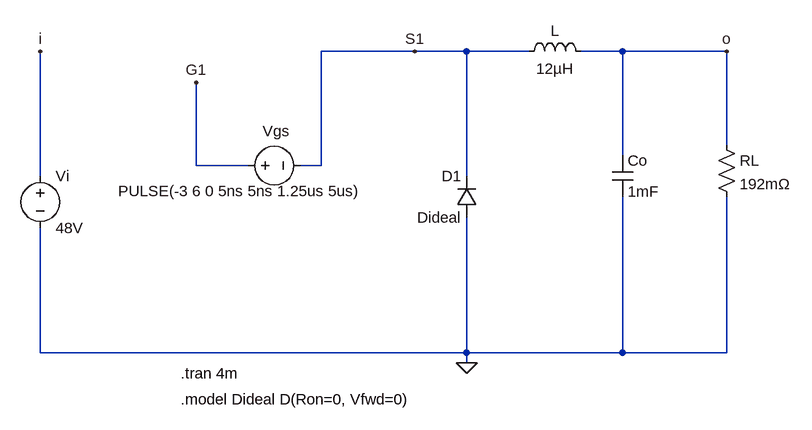
[diagram p0: schematic Project_5224_Buck_template.asc]
Project_5224_Buck_template.asc, the LTspice schematic file:
Version 4
SHEET 1 2328 680
WIRE 1024 -32 880 -32
WIRE 1104 -32 1024 -32
WIRE 1200 -32 1104 -32
WIRE 1344 -32 1280 -32
WIRE 1504 -32 1344 -32
WIRE 1504 112 1504 -32
WIRE 1344 128 1344 -32
WIRE 688 144 688 16
WIRE 768 144 688 144
WIRE 880 144 880 -32
WIRE 880 144 848 144
WIRE 448 160 448 -32
WIRE 1104 160 1104 -32
WIRE 448 432 448 240
WIRE 1104 432 1104 224
WIRE 1104 432 448 432
WIRE 1344 432 1344 192
WIRE 1344 432 1104 432
WIRE 1504 432 1504 192
WIRE 1504 432 1344 432
WIRE 1104 448 1104 432
FLAG 1504 -32 o
FLAG 448 -32 i
FLAG 1024 -32 S1
FLAG 688 16 G1
FLAG 1104 448 0
SYMBOL res 1488 96 R0
SYMATTR InstName RL
SYMATTR Value 192mΩ
SYMBOL voltage 448 144 R0
WINDOW 123 0 0 Left 0
WINDOW 39 0 0 Left 0
SYMATTR InstName Vi
SYMATTR Value 48V
SYMBOL ind 1184 -16 R270
WINDOW 0 32 56 VTop 2
WINDOW 3 5 56 VBottom 2
SYMATTR InstName L
SYMATTR Value 12µH
SYMBOL cap 1328 128 R0
SYMATTR InstName Co
SYMATTR Value 1mF
SYMBOL voltage 752 144 R270
WINDOW 0 53 38 VRight 2
WINDOW 3 -39 -184 VRight 2
WINDOW 123 0 0 Left 0
WINDOW 39 0 0 Left 0
SYMATTR InstName Vgs
SYMATTR Value PULSE(-3 6 0 5ns 5ns 1.25us 5us)
SYMBOL diode 1120 224 R180
WINDOW 0 24 64 Left 2
WINDOW 3 24 0 Left 2
SYMATTR InstName D1
SYMATTR Value Dideal
TEXT 664 464 Left 2 !.tran 4m
TEXT 664 504 Left 2 !.model Dideal D(Ron=0, Vfwd=0)

The netlist it stands for:
* Project_5224_Buck_template.asc
RL o 0 192mΩ
Vi i 0 48V
L S1 o 12µH
Co o 0 1mF
Vgs G1 S1 PULSE(-3 6 0 5ns 5ns 1.25us 5us)
D1 0 S1 Dideal
.model D D
.lib standard.dio
.tran 4m
.model Dideal D(Ron=0, Vfwd=0)
.backanno
.end